# Altium project CR2032_cableAdapter.PrjPcb
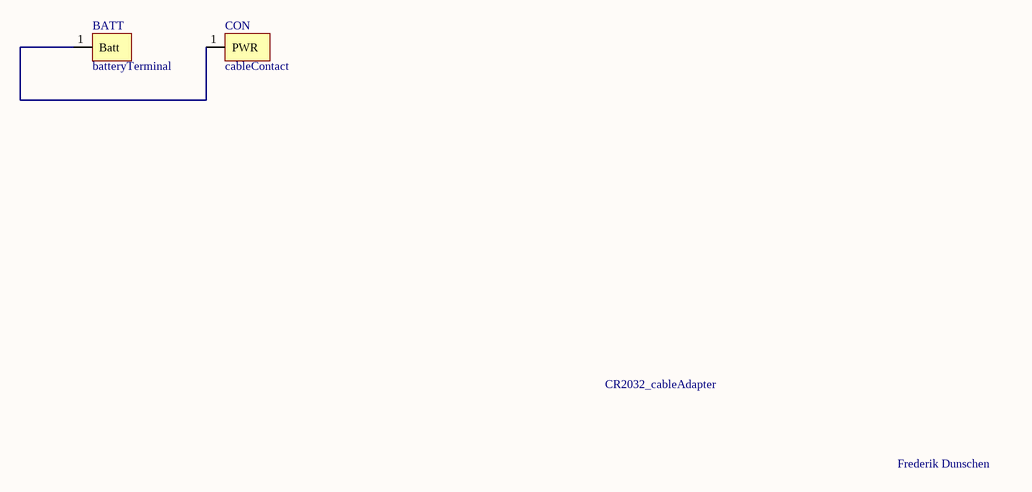
[diagram p0: Schematic.SchDoc]
1 sheet, 2 parts. Net scope: global (net labels, ports and power ports of the same name join across sheets).
Board file: singlePCB.PcbDoc

## Sheet Schematic.SchDoc
size A4

### Parts
BATT  batteryTerminal  [PCBComponent_1]
CON  cableContact  [CABLECONTQACT]

### Nets
NetBATT_1: BATT.1(Batt) CON.1(PWR)

### Notes on the sheet
- CR2032_cableAdapter
- Frederik Dunschen